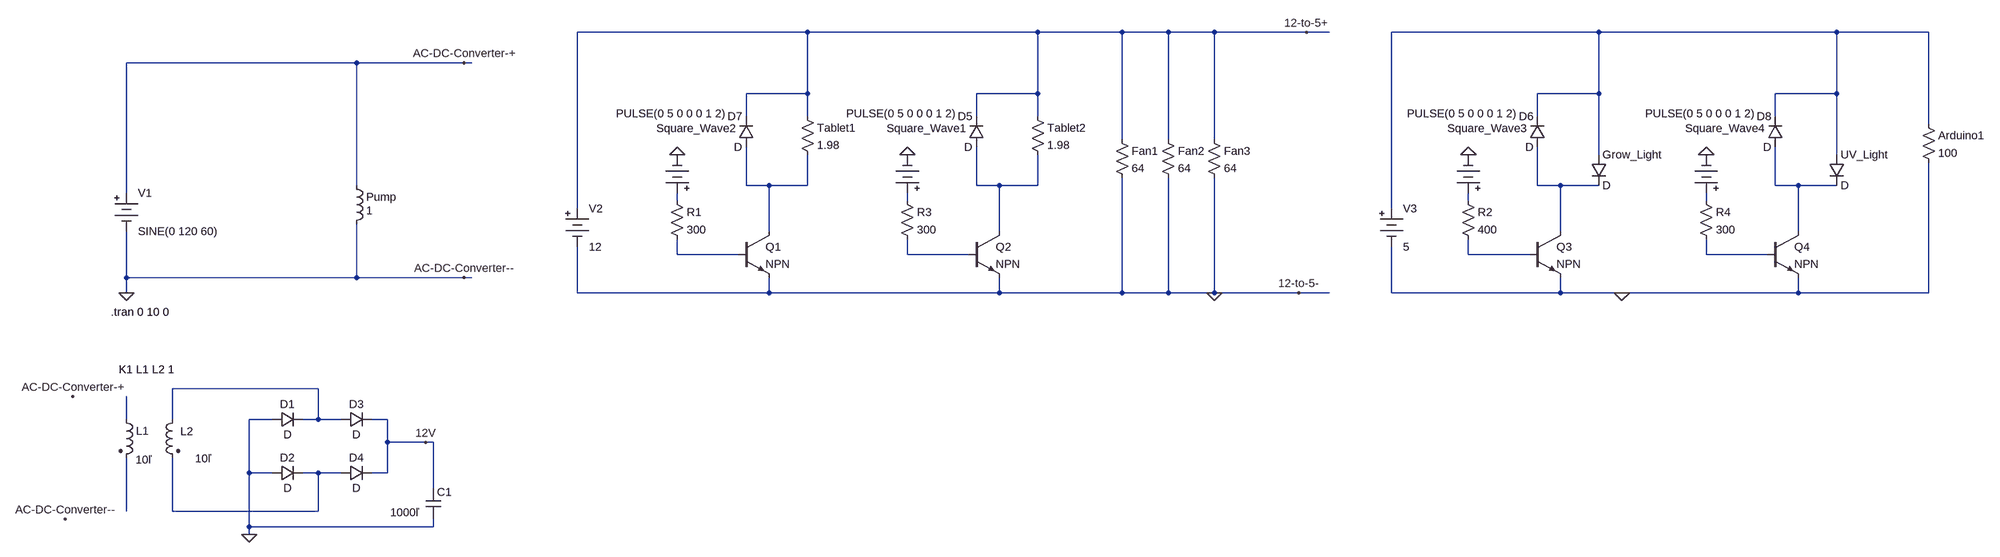
[diagram p0: schematic Hydroplant_Terrarium.asc]
Hydroplant_Terrarium.asc, the LTspice schematic file:
Version 4
SHEET 1 4864 996
WIRE 1744 -192 1264 -192
WIRE 2224 -192 1744 -192
WIRE 2400 -192 2224 -192
WIRE 2496 -192 2400 -192
WIRE 2592 -192 2496 -192
WIRE 2784 -192 2592 -192
WIRE 2832 -192 2784 -192
WIRE 3552 -192 3120 -192
WIRE 4048 -192 3552 -192
WIRE 4240 -192 4048 -192
WIRE 512 -128 32 -128
WIRE 736 -128 512 -128
WIRE 752 -128 736 -128
WIRE 1744 -64 1744 -192
WIRE 1744 -64 1616 -64
WIRE 2224 -64 2224 -192
WIRE 2224 -64 2096 -64
WIRE 3552 -64 3552 -192
WIRE 3552 -64 3424 -64
WIRE 4048 -64 4048 -192
WIRE 4048 -64 3920 -64
WIRE 1616 -16 1616 -64
WIRE 1744 -16 1744 -64
WIRE 2096 -16 2096 -64
WIRE 2224 -16 2224 -64
WIRE 3424 -16 3424 -64
WIRE 3920 -16 3920 -64
WIRE 4240 0 4240 -192
WIRE 2400 32 2400 -192
WIRE 2496 32 2496 -192
WIRE 2592 32 2592 -192
WIRE 3552 64 3552 -64
WIRE 4048 64 4048 -64
WIRE 512 128 512 -128
WIRE 1616 128 1616 48
WIRE 1664 128 1616 128
WIRE 1744 128 1744 64
WIRE 1744 128 1664 128
WIRE 2096 128 2096 48
WIRE 2144 128 2096 128
WIRE 2224 128 2224 64
WIRE 2224 128 2144 128
WIRE 3424 128 3424 48
WIRE 3472 128 3424 128
WIRE 3552 128 3472 128
WIRE 3920 128 3920 48
WIRE 3968 128 3920 128
WIRE 4048 128 3968 128
WIRE 32 144 32 -128
WIRE 1472 160 1472 144
WIRE 1952 160 1952 144
WIRE 3280 160 3280 144
WIRE 3776 160 3776 144
WIRE 1264 176 1264 -192
WIRE 3120 176 3120 -192
WIRE 1664 224 1664 128
WIRE 2144 224 2144 128
WIRE 3472 224 3472 128
WIRE 3968 224 3968 128
WIRE 1472 272 1472 240
WIRE 1600 272 1472 272
WIRE 1952 272 1952 240
WIRE 2080 272 1952 272
WIRE 3280 272 3280 240
WIRE 3408 272 3280 272
WIRE 3776 272 3776 240
WIRE 3904 272 3776 272
WIRE 32 320 32 224
WIRE 512 320 512 208
WIRE 512 320 32 320
WIRE 736 320 512 320
WIRE 752 320 736 320
WIRE 32 352 32 320
WIRE 1264 352 1264 256
WIRE 1664 352 1664 320
WIRE 1664 352 1264 352
WIRE 2144 352 2144 320
WIRE 2144 352 1664 352
WIRE 2400 352 2400 112
WIRE 2400 352 2144 352
WIRE 2496 352 2496 112
WIRE 2496 352 2400 352
WIRE 2592 352 2592 112
WIRE 2592 352 2496 352
WIRE 2768 352 2592 352
WIRE 2832 352 2768 352
WIRE 3120 352 3120 256
WIRE 3472 352 3472 320
WIRE 3472 352 3120 352
WIRE 3600 352 3472 352
WIRE 3968 352 3968 320
WIRE 3968 352 3600 352
WIRE 4240 352 4240 80
WIRE 4240 352 3968 352
WIRE 432 672 128 672
WIRE 32 736 32 688
WIRE 128 736 128 672
WIRE 336 736 288 736
WIRE 432 736 432 672
WIRE 432 736 400 736
WIRE 480 736 432 736
WIRE 576 736 544 736
WIRE 576 784 576 736
WIRE 656 784 576 784
WIRE 672 784 656 784
WIRE 288 848 288 736
WIRE 336 848 288 848
WIRE 432 848 400 848
WIRE 480 848 432 848
WIRE 576 848 576 784
WIRE 576 848 544 848
WIRE 672 880 672 784
WIRE 32 928 32 816
WIRE 128 928 128 816
WIRE 432 928 432 848
WIRE 432 928 128 928
WIRE 288 960 288 848
WIRE 672 960 672 944
WIRE 672 960 288 960
WIRE 288 976 288 960
FLAG 288 976 0
FLAG 32 352 0
FLAG 736 -128 AC-DC-Converter-+
FLAG 736 320 AC-DC-Converter--
FLAG -80 688 AC-DC-Converter-+
FLAG -96 944 AC-DC-Converter--
FLAG 2592 352 0
FLAG 1472 64 0
FLAG 656 784 12V
FLAG 2784 -192 12-to-5+
FLAG 2768 352 12-to-5-
FLAG 1952 64 0
FLAG 3280 64 0
FLAG 3776 64 0
FLAG 3600 352 0
SYMBOL Misc\\battery 32 128 R0
WINDOW 123 0 0 Left 0
WINDOW 39 0 0 Left 0
SYMATTR InstName V1
SYMATTR Value SINE(0 120 60)
SYMBOL ind2 16 720 R0
WINDOW 3 35 100 Left 2
SYMATTR Value 10ľ
SYMATTR InstName L1
SYMATTR Type ind
SYMBOL ind2 144 720 M0
WINDOW 0 -28 41 Left 2
WINDOW 3 -65 98 Left 2
SYMATTR InstName L2
SYMATTR Value 10ľ
SYMATTR Type ind
SYMBOL cap 656 880 R0
WINDOW 3 -74 50 Left 2
SYMATTR Value 1000ľ
SYMATTR InstName C1
SYMBOL diode 336 752 R270
WINDOW 0 32 32 VTop 2
WINDOW 3 0 32 VBottom 2
SYMATTR InstName D1
SYMBOL diode 336 864 R270
WINDOW 0 32 32 VTop 2
WINDOW 3 0 32 VBottom 2
SYMATTR InstName D2
SYMBOL diode 480 752 R270
WINDOW 0 32 32 VTop 2
WINDOW 3 0 32 VBottom 2
SYMATTR InstName D3
SYMBOL diode 480 864 R270
WINDOW 0 32 32 VTop 2
WINDOW 3 0 32 VBottom 2
SYMATTR InstName D4
SYMBOL ind 496 112 R0
WINDOW 3 36 68 Left 2
SYMATTR Value 1
SYMATTR InstName Pump
SYMBOL npn 1600 224 R0
SYMATTR InstName Q1
SYMBOL Misc\\battery 1472 160 R180
WINDOW 0 -123 151 Left 2
WINDOW 3 -102 182 Left 2
WINDOW 123 0 0 Left 0
WINDOW 39 0 0 Left 0
SYMATTR InstName Square_Wave2
SYMATTR Value PULSE(0 5 0 0 0 1 2)
SYMBOL res 4224 -16 R0
SYMATTR InstName Arduino1
SYMATTR Value 100
SYMBOL Misc\\battery 1264 160 R0
WINDOW 123 0 0 Left 0
WINDOW 39 0 0 Left 0
SYMATTR InstName V2
SYMATTR Value 12
SYMBOL diode 1632 48 R180
WINDOW 0 24 64 Left 2
WINDOW 3 24 0 Left 2
SYMATTR InstName D7
SYMBOL res 1456 144 R0
SYMATTR InstName R1
SYMATTR Value 300
SYMBOL res 1728 -32 R0
SYMATTR InstName Tablet1
SYMATTR Value 1.98
SYMBOL Misc\\battery 3120 160 R0
WINDOW 123 0 0 Left 0
WINDOW 39 0 0 Left 0
SYMATTR InstName V3
SYMATTR Value 5
SYMBOL npn 2080 224 R0
SYMATTR InstName Q2
SYMBOL Misc\\battery 1952 160 R180
WINDOW 0 -123 151 Left 2
WINDOW 3 -102 182 Left 2
WINDOW 123 0 0 Left 0
WINDOW 39 0 0 Left 0
SYMATTR InstName Square_Wave1
SYMATTR Value PULSE(0 5 0 0 0 1 2)
SYMBOL diode 2112 48 R180
WINDOW 0 24 64 Left 2
WINDOW 3 24 0 Left 2
SYMATTR InstName D5
SYMBOL res 1936 144 R0
SYMATTR InstName R3
SYMATTR Value 300
SYMBOL res 2208 -32 R0
SYMATTR InstName Tablet2
SYMATTR Value 1.98
SYMBOL npn 3408 224 R0
SYMATTR InstName Q3
SYMBOL Misc\\battery 3280 160 R180
WINDOW 0 -123 151 Left 2
WINDOW 3 -102 182 Left 2
WINDOW 123 0 0 Left 0
WINDOW 39 0 0 Left 0
SYMATTR InstName Square_Wave3
SYMATTR Value PULSE(0 5 0 0 0 1 2)
SYMBOL diode 3440 48 R180
WINDOW 0 24 64 Left 2
WINDOW 3 24 0 Left 2
SYMATTR InstName D6
SYMBOL res 3264 144 R0
SYMATTR InstName R2
SYMATTR Value 400
SYMBOL npn 3904 224 R0
SYMATTR InstName Q4
SYMBOL Misc\\battery 3776 160 R180
WINDOW 0 -123 151 Left 2
WINDOW 3 -102 182 Left 2
WINDOW 123 0 0 Left 0
WINDOW 39 0 0 Left 0
SYMATTR InstName Square_Wave4
SYMATTR Value PULSE(0 5 0 0 0 1 2)
SYMBOL diode 3936 48 R180
WINDOW 0 24 64 Left 2
WINDOW 3 24 0 Left 2
SYMATTR InstName D8
SYMBOL res 3760 144 R0
SYMATTR InstName R4
SYMATTR Value 300
SYMBOL diode 4032 64 R0
SYMATTR InstName UV_Light
SYMBOL diode 3536 64 R0
SYMATTR InstName Grow_Light
SYMBOL res 2384 16 R0
SYMATTR InstName Fan1
SYMATTR Value 64
SYMBOL res 2480 16 R0
SYMATTR InstName Fan2
SYMATTR Value 64
SYMBOL res 2576 16 R0
SYMATTR InstName Fan3
SYMATTR Value 64
TEXT 16 632 Left 2 !K1 L1 L2 1
TEXT 0 392 Left 2 !.tran 0 10 0

The netlist it stands for:
* Hydroplant_Terrarium.asc
V1 AC-DC-Converter-+ 0 SINE(0 120 60)
L1 N015 N017 10ľ
L2 N014 N016 10ľ
C1 12V 0 1000ľ
D1 0 N014 D
D2 0 N016 D
D3 N014 12V D
D4 N016 12V D
L§Pump AC-DC-Converter-+ 0 1
Q1 N002 N010 0 0 NPN
V§Square_Wave2 N006 0 PULSE(0 5 0 0 0 1 2)
R§Arduino1 N001 0 100
V2 12-to-5+ 0 12
D7 N002 12-to-5+ D
R1 N006 N010 300
R§Tablet1 12-to-5+ N002 1.98
V3 N001 0 5
Q2 N003 N011 0 0 NPN
V§Square_Wave1 N007 0 PULSE(0 5 0 0 0 1 2)
D5 N003 12-to-5+ D
R3 N007 N011 300
R§Tablet2 12-to-5+ N003 1.98
Q3 N004 N012 0 0 NPN
V§Square_Wave3 N008 0 PULSE(0 5 0 0 0 1 2)
D6 N004 N001 D
R2 N008 N012 400
Q4 N005 N013 0 0 NPN
V§Square_Wave4 N009 0 PULSE(0 5 0 0 0 1 2)
D8 N005 N001 D
R4 N009 N013 300
D§UV_Light N001 N005 D
D§Grow_Light N001 N004 D
R§Fan1 12-to-5+ 0 64
R§Fan2 12-to-5+ 0 64
R§Fan3 12-to-5+ 0 64
.model D D
.lib standard.dio
.model NPN NPN
.model PNP PNP
.lib standard.bjt
K1 L1 L2 1
.tran 0 10 0
.backanno
.end